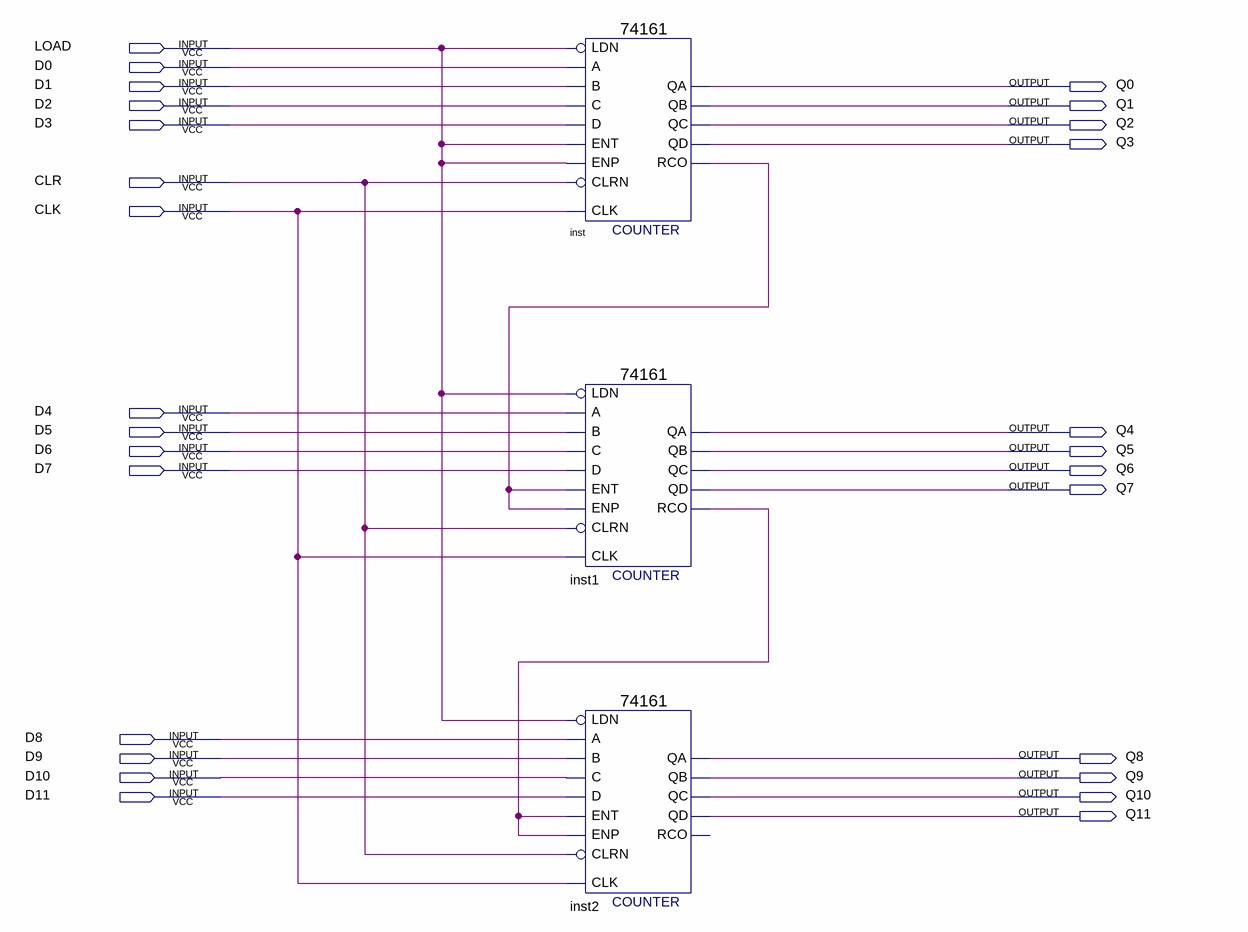
[diagram p0: schematic sheet]
// Quartus schematic upccg.bdf as structural Verilog: 3 symbols, 27 pins
module upccg (
  input  LOAD,
  input  D0,
  input  D1,
  input  D2,
  input  D3,
  input  CLR,
  input  CLK,
  input  D4,
  input  D5,
  input  D6,
  input  D7,
  input  D8,
  input  D9,
  input  D10,
  input  D11,
  output Q0,
  output Q1,
  output Q2,
  output Q3,
  output Q4,
  output Q5,
  output Q6,
  output Q7,
  output Q8,
  output Q9,
  output Q10,
  output Q11
);

  wire inst1_rco, inst_rco;

  \74161  inst (
    .CLRN(CLR), .CLK(CLK), .ENP(LOAD), .LDN(LOAD), .A(D0), .D(D3), .ENT(LOAD), .B(D1), .C(D2), .QD(Q3),
    .QC(Q2), .QB(Q1), .QA(Q0), .RCO(inst_rco));
  \74161  inst1 (
    .CLRN(CLR), .CLK(CLK), .ENP(inst_rco), .LDN(LOAD), .A(D4), .D(D7), .ENT(inst_rco), .B(D5), .C(D6),
    .QD(Q7), .QC(Q6), .QB(Q5), .QA(Q4), .RCO(inst1_rco));
  \74161  inst2 (
    .CLRN(CLR), .CLK(CLK), .ENP(inst1_rco), .LDN(LOAD), .A(D8), .D(D11), .ENT(inst1_rco), .B(D9), .C(D10),
    .QD(Q11), .QC(Q10), .QB(Q9), .QA(Q8));  // open: RCO
endmodule
